# Altium schematic sheet solar charger.SchDoc
size A4
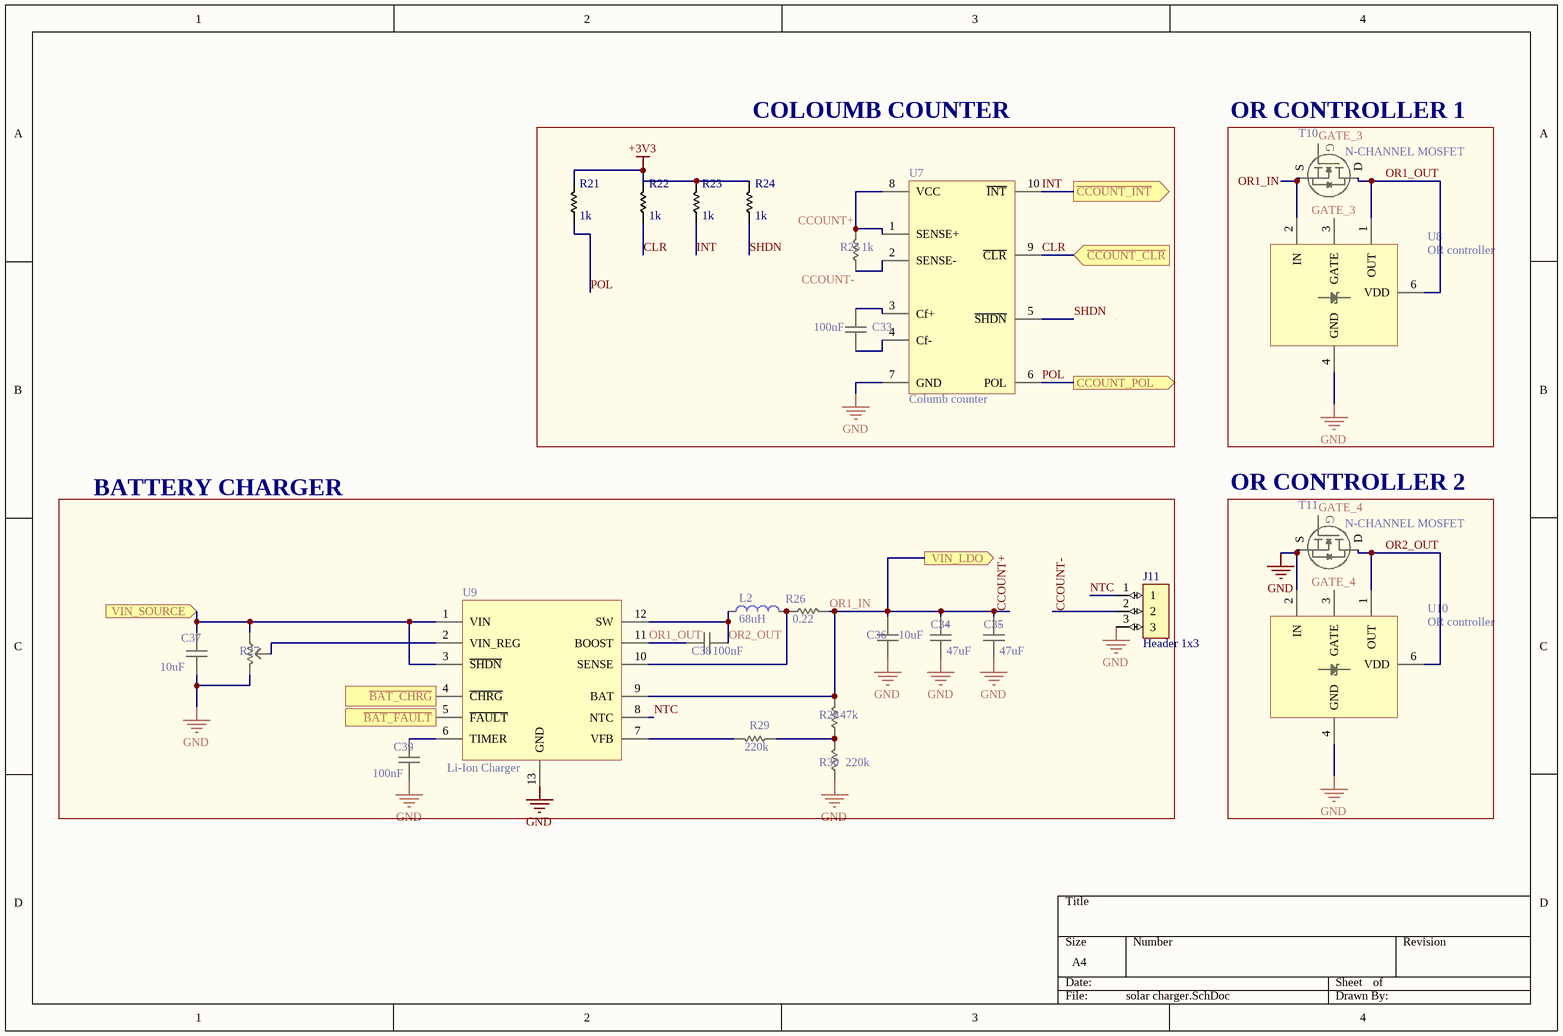
[diagram p0: solar charger.SchDoc]

## Parts
C33  value 100nF  [C0603]  (hidden comment: Capacitor 0603)
C34  value 47uF  [Capacitor electrolytic SMD 5x5.4]  (hidden comment: El. Capacitor SMD 5x5.4)
C35  value 47uF  [Capacitor electrolytic SMD 5x5.4]  (hidden comment: El. Capacitor SMD 5x5.4)
C36  value 10uF  [C0805]  (hidden comment: Capacitor 0805)
C37  value 10uF  [C0805]  (hidden comment: Capacitor 0805)
C38  value 100nF  [C0603]  (hidden comment: Capacitor 0603)
C39  value 100nF  [C0603]  (hidden comment: Capacitor 0603)
J11  Header 1x3  [Header 1x3 Male JST]
L2  value 68uH  [Inductor 1515]  (hidden comment: Inductor 1515)
R21  value 1k  [R0603]  (hidden comment: Resistor 0603)
R22  value 1k  [R0603]  (hidden comment: Resistor 0603)
R23  value 1k  [R0603]  (hidden comment: Resistor 0603)
R24  value 1k  [R0603]  (hidden comment: Resistor 0603)
R25  value 1k  [R0603]  (hidden comment: Resistor 0603)
R26  value 0.22  [R0603]  (hidden comment: Resistor 0603)
R27  Potentiometer  [Potentiometer 0505]  (value not drawn)
R28  value 47k  [R0603]  (hidden comment: Resistor 0603)
R29  value 220k  [R0603]  (hidden comment: Resistor 0603)
R30  value 220k  [R0603]  (hidden comment: Resistor 0603)
T10  N-CHANNEL MOSFET  [N-CHANNEL MOSFET]
T11  N-CHANNEL MOSFET  [N-CHANNEL MOSFET]
U7  Columb counter  [LTC4150]
U8  OR controller  [DFN 6-pins]
U9  Li-Ion Charger  [DFN 12-PINS]
U10  OR controller  [DFN 6-pins]

## Blocks framed on the sheet
COLOUMB COUNTER: C33 R21-R25 U7
OR CONTROLLER 1: T10 U8
BATTERY CHARGER: C34-C39 J11 L2 R26-R30 U9
OR CONTROLLER 2: T11 U10

## Ports
CCOUNT_POL (out), VIN_LDO (out), VIN_SOURCE (in), ~{BAT_CHRG} (in), ~{BAT_FAULT} (in), ~{CCOUNT_CLR} (in), ~{CCOUNT_INT} (out)

## Nets
+3V3: R21.2 R22.2 R23.2 R24.2
GND: C34.2 C35.2 C36.1 C37.1 C39.1 J11.3 R27.3 R30.1 T11.2(S) U7.7(GND) U8.4(GND) U9.13(GND) U10.2(IN) U10.4(GND)
~{BAT_CHRG}: U9.4(~{CHRG}) ; port ~{BAT_CHRG}
~{BAT_FAULT}: U9.5(~{FAULT}) ; port ~{BAT_FAULT}
CCOUNT+: C34.1 C35.1 C36.2 R25.2 R26.2 R28.2 T10.2(S) U7.1(SENSE+) U7.8(VCC) U8.2(IN) U9.9(BAT) ; port VIN_LDO  [also labelled OR1_IN]
CCOUNT-: J11.2 R25.1 U7.2(SENSE-)
CLR: R22.1 U7.9(~{CLR}) ; port ~{CCOUNT_CLR}
GATE_3: T10.1(G) U8.3(GATE)
GATE_4: T11.1(G) U10.3(GATE)
INT: R23.1 U7.10(~{INT}) ; port ~{CCOUNT_INT}
NTC: J11.1 U9.8(NTC)
OR1_OUT: C38.1 T10.3(D) U8.1(OUT) U8.6(VDD) U9.11(BOOST)
OR2_OUT: C38.2 L2.1 T11.3(D) U9.12(SW) U10.1(OUT) U10.6(VDD)
POL: R21.1 U7.6(POL) ; port CCOUNT_POL
SHDN: R24.1 U7.5(~{SHDN})
VIN_SOURCE: C37.2 R27.1 U9.1(VIN) U9.3(~{SHDN}) ; port VIN_SOURCE
NetC33_1: C33.1 U7.4(Cf-)
NetC33_2: C33.2 U7.3(Cf+)
NetC39_2: C39.2 U9.6(TIMER)
NetL2_2: L2.2 R26.1 U9.10(SENSE)
NetR27_2: R27.2 U9.2(VIN_REG)
NetR28_1: R28.1 R29.1 R30.2
NetR29_2: R29.2 U9.7(VFB)

## Notes on the sheet
- (in symbol El. Capacitor SMD 5x5.4) +

## Library data of the parts
J11 = Header 1x3 Male
L2 = Inductor 1515: type: MSS1583-683MED
R27 = Potentiometer 0505
U7 = Coulomb counter
U8 U10 = OR controller: LTC4357
U9 = Litium battery charger